# EAGLE design zepir-LCD-audio (EAGLE 7.6.0)
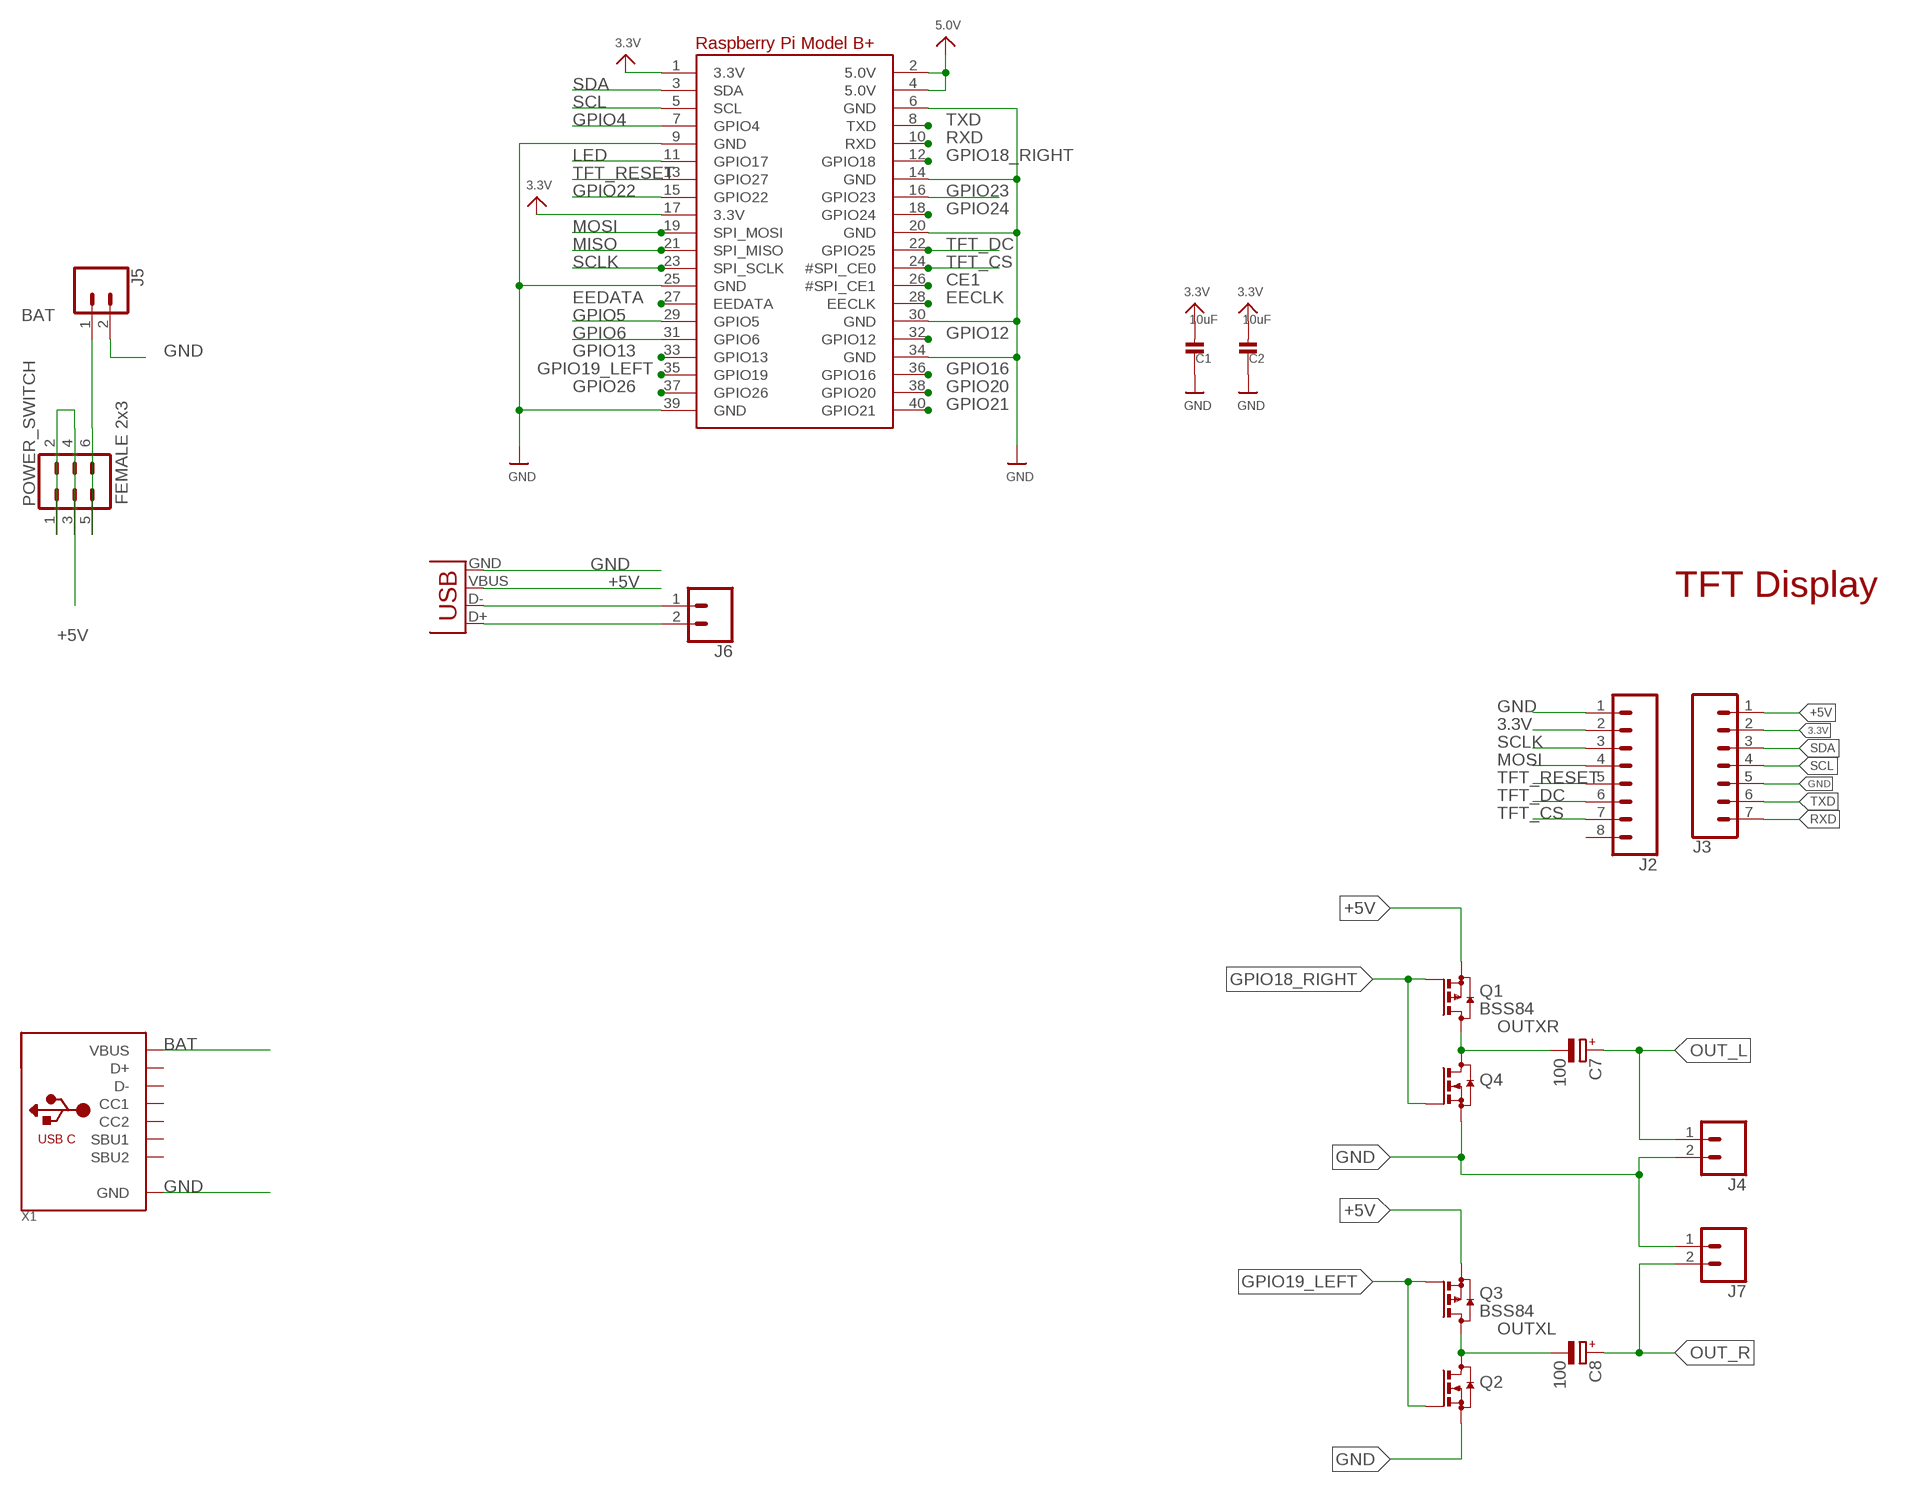
[diagram p0: schematic, sheet 1]

## Parts
C1  10uF  CAP_CERAMIC_1206  [_1206]
C2  10uF  CAP_CERAMIC_1206  [_1206]
C7  100  CPOL-EUB/3528-21R  [B/3528-21R]
C8  100  CPOL-EUB/3528-21R  [B/3528-21R]
J2  CONN_08LONGPADS  [1X08_LONGPADS]
J3  CONN_07LONGPADS  [1X07_LONGPADS]
J4  CONN_02PTH3  [1X02_LONGPADS]
J5  CONN_02PTH3  [1X02_LONGPADS]
J6  CONN_02  [1X02]
J7  CONN_02PTH3  [1X02_LONGPADS]
POWER_SWITCH  FEMALE 2x3  CONN_03X2FEMALE  [2X3]
Q1  BSS84  [SOT23]
Q2  BSS123  [SOT23]
Q3  BSS84  [SOT23]
Q4  BSS123  [SOT23]
RPI1  RASPBERRYPI_BPLUS_BONNETNODIM  [PI_BONNET_NODIM]
USBIN1  USB-A-SMD  [USB-A-S-NOSILK-FEMALE]
X1  USB_C  [USB_C_CUSB31-CFM2AX-01-X]

## Nets
3.3V: C1.2 C2.2 J2.2 J3.2 RPI1.1(3.3V) RPI1.17(3.3V)
+5V [xxx]: J3.1 POWER_SWITCH.1 POWER_SWITCH.2 POWER_SWITCH.3 POWER_SWITCH.4 Q1.2(S) Q3.2(S) RPI1.2(5.0V) RPI1.4(5.0V) USBIN1.VBUS ; supply symbol labelled 5.0V
BAT: J5.1 POWER_SWITCH.5 POWER_SWITCH.6 X1.A4B9(VBUS) X1.B4A9(VBUS)
CE1: RPI1.26(#SPI_CE1)
DM: J6.1 USBIN1.D-
DP: J6.2 USBIN1.D+
EECLK: RPI1.28(EECLK)
EEDATA: RPI1.27(EEDATA)
GND [gnd]: C1.1 C2.1 J2.1 J3.5 J4.2 J5.2 J7.1 Q2.2(S) Q4.2(S) RPI1.6(GND) RPI1.9(GND) RPI1.14(GND) RPI1.20(GND) RPI1.25(GND) RPI1.30(GND) RPI1.34(GND) RPI1.39(GND) USBIN1.GND X1.A1B12(GND) X1.B1A12(GND)
GPIO4: RPI1.7(GPIO4)
GPIO5: RPI1.29(GPIO5)
GPIO6: RPI1.31(GPIO6)
GPIO12: RPI1.32(GPIO12)
GPIO13: RPI1.33(GPIO13)
GPIO16: RPI1.36(GPIO16)
GPIO18_RIGHT: Q1.1(G) Q4.1(G) RPI1.12(GPIO18)
GPIO19_LEFT: Q2.1(G) Q3.1(G) RPI1.35(GPIO19)
GPIO20: RPI1.38(GPIO20)
GPIO21: RPI1.40(GPIO21)
GPIO22: RPI1.15(GPIO22)
GPIO23: RPI1.16(GPIO23)
GPIO24: RPI1.18(GPIO24)
GPIO26: RPI1.37(GPIO26)
LED: RPI1.11(GPIO17)
MISO: RPI1.21(SPI_MISO)
MOSI: J2.4 RPI1.19(SPI_MOSI)
OUT_L: C7.+ J4.1
OUT_R: C8.+ J7.2
OUTXL: C8.- Q2.3(D) Q3.3(D)
OUTXR: C7.- Q1.3(D) Q4.3(D)
RXD: J3.7 RPI1.10(RXD)
SCL: J3.4 RPI1.5(SCL)
SCLK: J2.3 RPI1.23(SPI_SCLK)
SDA: J3.3 RPI1.3(SDA)
TFT_CS: J2.7 RPI1.24(#SPI_CE0)
TFT_DC: J2.6 RPI1.22(GPIO25)
TFT_RESET: J2.5 RPI1.13(GPIO27)
TXD: J3.6 RPI1.8(TXD)
Unconnected: J2.8 X1.A5(CC1) X1.A6(D+) X1.A7(D-) X1.A8(SBU1) X1.B5(CC2) X1.B6(D+) X1.B7(D-) X1.B8(SBU2)

## Notes on the sheet
- TFT Display

## Library data of the parts
C1 C2 = microbuilder:CAP_CERAMIC: Ceramic Capacitors For new designs, use the packages preceded by an '_' character since they are more reliable: The following footprints should be used on most boards: _0402 - Standard footprint for regular board layouts _0603 - Standard footprint for regular board layouts _0805 - Standard footprint for regular board layouts _1206 - Standard footprint for regular board layouts For extremely tight-pitch boards where space is at a premium, the following 'micro-pitch' footprints can be used (smaller pads, no silkscreen outline, etc.): _0402MP - Micro-pitch footprint for very dense/compact boards _0603MP - Micro-pitch footprint for very dense/compact boards _0805MP - Micro-pitch footprint for very dense/compact boards _1206MP - Micro-pitch footprint for very dense/compact boards
C7 C8 = resistor:CPOL-EU: POLARIZED CAPACITOR, European symbol
J2 = SparkFun-Connectors:CONN_08: Multi connection point. Often used as Generic Header-pin footprint for 0.1 inch spaced/style header connections On any of the 0.1 inch spaced packages, you can populate with these: Break Away Headers - Straight <https://www.sparkfun.com/products/116> (PRT-00116) Break Away Male Headers - Right Angle <https://www.sparkfun.com/products/553> (PRT-00553) Female Headers <https://www.sparkfun.com/products/115> (PRT-00115) Break Away Headers - Machine Pin <https://www.sparkfun.com/products/117> (PRT-00117) Break Away Female Headers - Swiss Machine Pin <https://www.sparkfun.com/products/743> (PRT-00743) Arduino Stackable Header - 8 Pin <https://www.sparkfun.com/products/9279> (PRT-09279) For SCREWTERMINALS and SPRING TERMINALS visit here: Screw Terimnals on SparkFun.com <https://www.sparkfun.com/search/results?term=Screw+Terminals> (5mm/3.5mm/2.54mm spacing) This device is also useful as a general connection point to wire up your design to another part of your project. Our various solder wires solder well into these plated through hole pads. Hook-Up Wire - Assortment (Stranded, 22 AWG) <https://www.sparkfun.com/products/11375> (PRT-11375) Hook-Up Wire - Assortment (Solid Core, 22 AWG) <https://www.sparkfun.com/products/11367> (PRT-11367) View the entire wire category on our website here <https://www.sparkfun.com/categories/141> Special notes: Molex polarized connector foot print use with SKU : PRT-08231 with associated crimp pins and housings. 1MM SMD Version SKU: PRT-10208 NOTES ON THE VARIANTS LOCK and LOCK_LONGPADS... This footprint was designed to help hold the alignment of a through-hole component (i.e. 6-pin header) while soldering it into place. You may notice that each hole has been shifted either up or down by 0.005 of an inch from it's more standard position (which is a perfectly straight line). This slight alteration caused the pins (the squares in the middle) to touch the edges of the holes. Because they are alternating, it causes a "brace" to hold the component in place. 0.005 has proven to be the perfect amount of "off-center" position when using our standard breakaway headers. Although looks a little odd when you look at the bare footprint, once you have a header in there, the alteration is very hard to notice. Also,if you push a header all the way into place, it is covered up entirely on the bottom side.
J3 = SparkFun-Connectors:CONN_07: Multi connection point. Often used as Generic Header-pin footprint for 0.1 inch spaced/style header connections On any of the 0.1 inch spaced packages, you can populate with these: Break Away Headers - Straight <https://www.sparkfun.com/products/116> (PRT-00116) Break Away Male Headers - Right Angle <https://www.sparkfun.com/products/553> (PRT-00553) Female Headers <https://www.sparkfun.com/products/115> (PRT-00115) Break Away Headers - Machine Pin <https://www.sparkfun.com/products/117> (PRT-00117) Break Away Female Headers - Swiss Machine Pin <https://www.sparkfun.com/products/743> (PRT-00743) For SCREWTERMINALS and SPRING TERMINALS visit here: Screw Terimnals on SparkFun.com <https://www.sparkfun.com/search/results?term=Screw+Terminals> (5mm/3.5mm/2.54mm spacing) This device is also useful as a general connection point to wire up your design to another part of your project. Our various solder wires solder well into these plated through hole pads. Hook-Up Wire - Assortment (Stranded, 22 AWG) <https://www.sparkfun.com/products/11375> (PRT-11375) Hook-Up Wire - Assortment (Solid Core, 22 AWG) <https://www.sparkfun.com/products/11367> (PRT-11367) View the entire wire category on our website here <https://www.sparkfun.com/categories/141> Special notes: Molex polarized connector foot print use with SKU : PRT-08231 with associated crimp pins and housings. 1MM SMD Version SKU: PRT-10208 NOTES ON THE VARIANTS LOCK and LOCK_LONGPADS... This footprint was designed to help hold the alignment of a through-hole component (i.e. 6-pin header) while soldering it into place. You may notice that each hole has been shifted either up or down by 0.005 of an inch from it's more standard position (which is a perfectly straight line). This slight alteration caused the pins (the squares in the middle) to touch the edges of the holes. Because they are alternating, it causes a "brace" to hold the component in place. 0.005 has proven to be the perfect amount of "off-center" position when using our standard breakaway headers. Although looks a little odd when you look at the bare footprint, once you have a header in there, the alteration is very hard to notice. Also,if you push a header all the way into place, it is covered up entirely on the bottom side.
J4-J7 = SparkFun-Connectors:CONN_02: Multi connection point. Often used as Generic Header-pin footprint for 0.1 inch spaced/style header connections On any of the 0.1 inch spaced packages, you can populate with these: Break Away Headers - Straight <https://www.sparkfun.com/products/116> (PRT-00116) Break Away Male Headers - Right Angle <https://www.sparkfun.com/products/553> (PRT-00553) Female Headers <https://www.sparkfun.com/products/115> (PRT-00115) Break Away Headers - Machine Pin <https://www.sparkfun.com/products/117> (PRT-00117) Break Away Female Headers - Swiss Machine Pin <https://www.sparkfun.com/products/743> (PRT-00743) For SCREWTERMINALS and SPRING TERMINALS visit here: Screw Terimnals on SparkFun.com <https://www.sparkfun.com/search/results?term=Screw+Terminals> (5mm/3.5mm/2.54mm spacing) This device is also useful as a general connection point to wire up your design to another part of your project. Our various solder wires solder well into these plated through hole pads. Hook-Up Wire - Assortment (Stranded, 22 AWG) <https://www.sparkfun.com/products/11375> (PRT-11375) Hook-Up Wire - Assortment (Solid Core, 22 AWG) <https://www.sparkfun.com/products/11367> (PRT-11367) View the entire wire category on our website here <https://www.sparkfun.com/categories/141> Special notes: Molex polarized connector foot print use with: PRT-08233 with associated crimp pins and housings. 2.54_SCREWTERM for use with PRT-10571. 3.5mm Screw Terminal footprints for PRT-08084 5mm Screw Terminal footprints for use with PRT-08432
POWER_SWITCH = SparkFun-Connectors:CONN_03X2: Multi connection point. Often used as Generic Header-pin footprint for 0.1 inch spaced/style header connections You can populate with any combo of single row headers, but if you'd like an exact match, check these: Header - 2x3 (Male, 0.1") <https://www.sparkfun.com/products/12807> (PRT-12807) Header - 2x3 (Female, 0.1") <https://www.sparkfun.com/products/13010> (PRT-13010) 2x3 Pin Shrouded Header <https://www.sparkfun.com/products/10877> (PRT-10877) On any of the 0.1 inch spaced packages, you can populate with these: Break Away Headers - Straight <https://www.sparkfun.com/products/116> (PRT-00116) Break Away Male Headers - Right Angle <https://www.sparkfun.com/products/553> (PRT-00553) Female Headers <https://www.sparkfun.com/products/115> (PRT-00115) Break Away Headers - Machine Pin <https://www.sparkfun.com/products/117> (PRT-00117) Break Away Female Headers - Swiss Machine Pin <https://www.sparkfun.com/products/743> (PRT-00743) Special note: the shrouded connector mates well with our 3x2 ribbon cables: Ribbon Crimp Connector - 6-pin (2x3, Female) <https://www.sparkfun.com/products/10651> (PRT-10651) Ribbon Cable - 6 wire (15ft) <https://www.sparkfun.com/products/10646> (PRT-10646); PROD_ID: CONN-11566
Q1 Q3 = transistor-small-signal:BSS84: P-CHANNEL MOS FET
Q2 Q4 = transistor-small-signal:BSS123: N-CHANNEL MOS FET
RPI1 = adafruit_sbc:RASPBERRYPI_BPLUS
USBIN1 = SparkFun:USB: USB Connectors USB-B-PTH is fully proven SKU : PRT-00139 USB-miniB is fully proven SKU : PRT-00587 USB-A-PCB is untested. USB-A-H is throughly reviewed, but untested. Spark Fun Electronics SKU : PRT-00437 USB-B-SMT is throughly reviewed, but untested. Needs silkscreen touching up. USB-A-S has not been used/tested USB-MB-H has not been used/tested
X1 = microbuilder:USB_C: USB Type-C USB 2.0 Connector

## Net classes
0 vcc: width 0.203 mm, drill 0.356 mm, clearance 0.305 mm
1 gnd: width 0.203 mm, drill 0.356 mm, clearance 0.305 mm
2 xxx: width 0.203 mm, drill 0.356 mm, clearance 0.305 mm

## Board
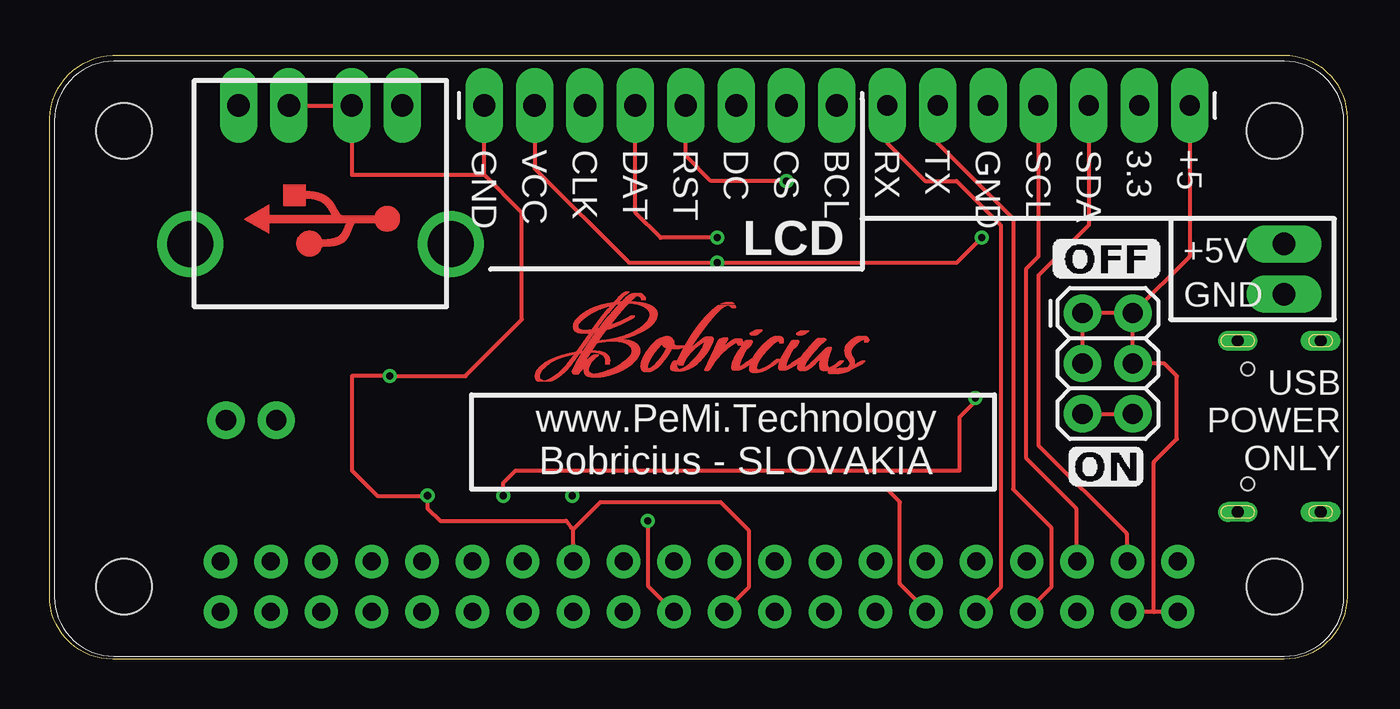
[diagram p1: board, top side]
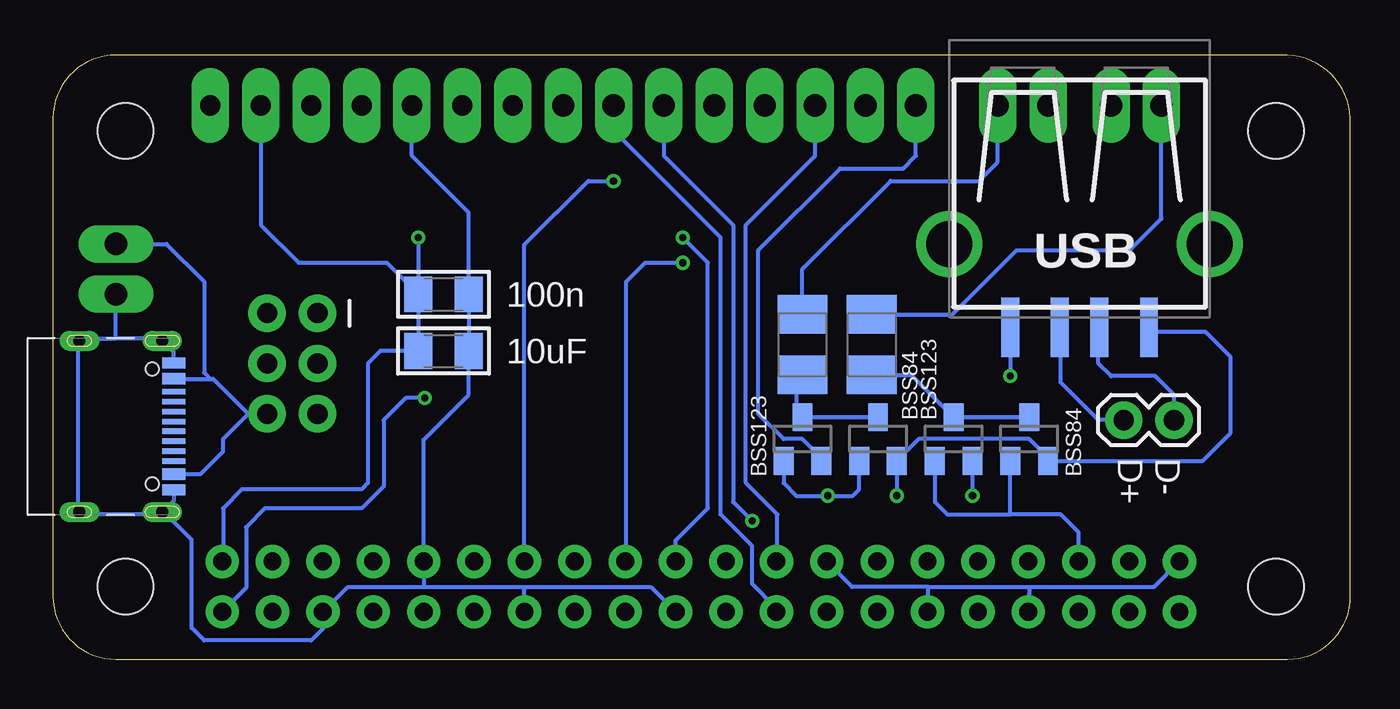
[diagram p2: board, bottom side, seen from below]

Size 65.41 x 30.48 mm. Coordinates in mm from the lower left corner, seen from the top.
Outline: 3.49,30.48 62.23,30.48 arc-90 65.41,27.31 65.41,3.17 arc-90 62.23,0 3.18,0 arc-90 0,3.17 0,27.31 arc-90 3.49,30.48
Copper layers (1*16): Top 0.0356mm / dielectric 1.5011mm / Bottom 0.0356mm
Design rules "LaenPCBOrder *": minimum track width 6mil, minimum drill 13mil, track to track 6mil, track to pad 6mil, pad to pad 6mil, via to via 6mil, smd to smd 6mil, copper to edge 15mil, drill to drill 6mil, minimum pad ring 7mil, minimum via ring 7mil, stop-mask expansion 4mil, vias tented up to drill 30mil, thermal gap 10mil

### Footprints (pad centres in the part's own frame; a part is rotated, then mirrored left to right if it is on the bottom)
_1206 = smd 1.4 x 1.8: 1 -1.27,0; 2 1.27,0
B/3528-21R = smd 1.95 x 2.5: + 1.525,0; - -1.525,0
1X08_LONGPADS = drill 1.118 pad 1.88 long: 1 0,0; 2 2.54,0; 3 5.08,0; 4 7.62,0; 5 10.16,0; 6 12.7,0; 7 15.24,0; 8 17.78,0
1X07_LONGPADS = drill 1.016 pad 1.88 long: 1 0,0; 2 2.54,0; 3 5.08,0; 4 7.62,0; 5 10.16,0; 6 12.7,0; 7 15.24,0
1X02_LONGPADS = drill 1.118 pad 1.88 long: 1 0,0; 2 2.54,0
1X02 = drill 1.016 pad 1.88: 1 0,0; 2 2.54,0
2X3 = drill 1.016 pad 1.88: 1 0,0; 2 0,2.54; 3 2.54,0; 4 2.54,2.54; 5 5.08,0; 6 5.08,2.54
SOT23 = smd 1 x 1.4: 1 -0.95,-1.1; 2 0.95,-1.1; 3 0,1.1
PI_BONNET_NODIM = drill 0.9 pad 1.676: 1 8.37,25.23; 2 8.37,27.77; 3 10.91,25.23; 4 10.91,27.77; 5 13.45,25.23; 6 13.45,27.77; 7 15.99,25.23; 8 15.99,27.77; 9 18.53,25.23; 10 18.53,27.77; 11 21.07,25.23; 12 21.07,27.77; 13 23.61,25.23; 14 23.61,27.77; 15 26.15,25.23; 16 26.15,27.77; 17 28.69,25.23; 18 28.69,27.77; 19 31.23,25.23; 20 31.23,27.77; 21 33.77,25.23; 22 33.77,27.77; 23 36.31,25.23; 24 36.31,27.77; 25 38.85,25.23; 26 38.85,27.77; 27 41.39,25.23; 28 41.39,27.77; 29 43.93,25.23; 30 43.93,27.77; 31 46.47,25.23; 32 46.47,27.77; 33 49.01,25.23; 34 49.01,27.77; 35 51.55,25.23; 36 51.55,27.77; 37 54.09,25.23; 38 54.09,27.77; 39 56.63,25.23; 40 56.63,27.77 | hole 2.8: 3.5,3.5; 3.5,26.5; 61.5,26.5; 61.5,3.5
USB-A-S-NOSILK-FEMALE = smd 3 x 0.9: D+ 4.212,-1; D- 4.212,1; GND 4.212,-3.5; VBUS 4.212,3.5 | drill 2.311: P$5 0,-6.566; P$6 0,6.566
USB_C_CUSB31-CFM2AX-01-X = smd 0.575 x 1.15: A1B12 -3.2,7.355; A4B9 -2.4,7.355; B1A12 3.2,7.355; B4A9 2.4,7.355 | smd 0.275 x 1.15: A5 -1.25,7.355; A6 -0.25,7.355; A7 0.25,7.355; A8 1.25,7.355; B5 1.75,7.355; B6 0.75,7.355; B7 -0.75,7.355; B8 -1.75,7.355 | drill 0.6 pad 1 long: M1 -4.32,6.78; M2 4.32,6.78; M3 -4.32,2.6; M4 4.32,2.6 | hole 0.65: 2.89,6.28; -2.89,6.28

### Placement (x,y rotation side)
C1  45.72,18.42 180 bottom
C2  45.72,15.56 180 bottom
C7  27.62,15.88 90 bottom
C8  24.13,15.88 90 bottom
J2  21.91,27.94 0 top
J3  57.47,27.94 180 top
J4  17.78,27.94 180 top
J5  62.23,20.96 270 top
J6  8.89,12.07 180 bottom
J7  12.07,27.94 180 top
POWER_SWITCH  52.07,17.46 270 top
Q1  23.81,11.11 0 bottom
Q2  20,11.11 0 bottom
Q3  16.19,11.11 0 bottom
Q4  27.62,11.11 0 bottom
RPI1  65.25,30.16 180 top
USBIN1  13.65,20.96 270 bottom
X1  66.68,11.75 270 bottom

### Tracks (layer width: path | path; a pad name or v marks a point on that pad's centre or on a via)
3.3V  (via drill 0.36)
  Top 0.203: J2.2 24.45,24.77 29.21,20 v33.65,20 45.72,20 v46.99,21.27 | v36.51,4.98 RPI1.17
  Bottom 0.203: RPI1.1 56.83,4.98 56.83,7.62 55.88,8.57 49.85,8.57 49.53,8.89 49.53,14.92 48.9,15.56 C2.2 C1.2 | J3.2 54.93,21.91 53.02,20 48.58,20 C1.2 | v36.51,4.98 36.51,19.05 35.56,20 v33.65,20 | v46.99,21.27 C1.2
+5V  (via drill 0.36)
  Top 0.203: J3.1 57.47,20.32 POWER_SWITCH.2 | POWER_SWITCH.2 POWER_SWITCH.1 POWER_SWITCH.3 | POWER_SWITCH.2 POWER_SWITCH.4 56.2,14.92 56.83,14.29 56.83,11.11 55.67,9.95 55.67,2.39 | RPI1.2 55.67,2.39 | 55.67,2.39 RPI1.4 | v22.86,8.26 22.86,8.89 23.49,9.53 45.88,9.53 45.88,12.22 46.67,13.02 v46.67,13.18
  Bottom 0.203: v46.67,13.18 47.62,13.18 48.74,12.06 48.74,8.73 49.85,7.62 54.72,7.62 55.67,6.67 55.67,3.6 RPI1.2 | USBIN1.VBUS 9.92,16.51 7.3,16.51 6.03,15.24 6.03,11.43 7.45,10.01 Q3.2 15.24,10.16 16.19,11.11 21.76,11.11 Q1.2 v22.86,8.26
BAT
  Top 0.203: POWER_SWITCH.5 POWER_SWITCH.6
  Bottom 0.203: POWER_SWITCH.6 55.56,12.38 | 55.56,12.38 57.33,14.15 57.47,14.15 | X1.A4B9 57.47,14.15 | X1.B4A9 57.96,9.35 56.83,10.48 56.83,11.11 55.56,12.38 | J5.1 59.69,20.96 57.79,19.05 57.79,14.46 57.47,14.15
DM
  Bottom 0.203: J6.1 8.89,13.34 9.84,14.29 12.07,14.29 12.7,14.92 12.7,16.7 USBIN1.D-
DP
  Bottom 0.203: J6.2 12.7,12.06 14.6,13.97 14.6,16.7 USBIN1.D+
GND  (via drill 0.36)
  Top 0.203: 21.91,24.45 15.24,24.45 J4.2 J7.1 | 21.91,24.45 J2.1 | RPI1.25 26.4,6.55 | 26.4,6.55 27.78,7.94 33.81,7.94 35.24,6.51 35.24,3.62 RPI1.20 | 26.4,6.55 26.28,6.67 26.04,6.99 19.68,6.99 19.05,7.62 v19.05,8.26 16.51,8.26 15.24,9.53 15.24,14.29 v17.15,14.29 20.96,14.29 23.81,17.14 23.81,22.54 21.91,24.45
  Bottom 0.203: J3.5 47.31,25.4 44.45,22.54 C1.1 C2.1 44.45,13.34 46.72,11.07 RPI1.9 46.72,3.69 46.67,3.65 | X1.B1A12 59.32,7.99 59.85,7.46 | 59.85,7.46 60.01,7.3 64.13,7.3 64.13,16.19 62.23,16.19 | 62.23,16.19 60.01,16.19 59.32,15.5 X1.A1B12 | 62.23,16.19 J5.2 | 16.2,3.65 16.2,3.31 RPI1.34 | 46.67,3.65 41.75,3.65 | 41.75,3.65 35.27,3.65 RPI1.20 | RPI1.14 41.64,3.54 41.75,3.65 | 46.67,3.65 50.54,3.65 RPI1.6 51.8,1.54 52.39,0.95 57.79,0.95 58.42,1.59 58.42,6.03 59.85,7.46 | RPI1.30 21.27,2.44 21.27,3.65 | 21.27,3.65 16.2,3.65 | 21.27,3.65 25.12,3.65 RPI1.25 | 16.2,3.65 9.9,3.65 RPI1.39 | Q2.2 v19.05,8.26 | USBIN1.GND v17.15,14.29 | Q4.2 26.67,10.16 27.62,11.11 28.57,11.11 29.85,12.38 29.85,20.64 25.72,24.77 22.54,24.77 21.91,25.4 J2.1
GPIO18_RIGHT  (via drill 0.36)
  Top 0.203: RPI1.12 44.18,2.5 42.86,3.81 42.86,7.94 42.23,8.57 26.67,8.57 v26.35,8.26
  Bottom 0.203: Q4.1 28.57,8.89 27.94,8.26 v26.35,8.26 25.08,8.26 24.76,8.57 Q1.1
GPIO19_LEFT
  Bottom 0.203: Q2.1 20.95,7.94 20.32,7.3 17.15,7.3 | 17.15,7.3 Q3.1 | RPI1.35 13.7,6.39 14.6,7.3 17.15,7.3
MOSI  (via drill 0.36)
  Top 0.203: v33.65,21.27 30.8,21.27 29.53,22.54 J2.4
  Bottom 0.203: RPI1.19 34.02,5.99 32.38,7.62 32.38,20 v33.65,21.27
OUT_L
  Bottom 0.203: C7.+ 27.62,19.68 23.18,24.13 18.73,24.13 17.78,25.08 J4.1
OUT_R
  Bottom 0.203: C8.+ 20.07,17.4 16.83,20.64 11.11,20.64 9.52,22.23 J7.2
OUTXL
  Bottom 0.203: Q3.3 Q2.3 22.14,14.35 C8.-
OUTXR
  Bottom 0.203: Q1.3 Q4.3 | Q4.3 27.94,12.21 27.94,12.7 | 27.94,12.7 27.62,12.7 Q4.3 | C7.- 27.94,14.35 27.94,12.7
RXD
  Top 0.203: J3.7 42.23,26.03 44.13,24.13 45.72,24.13 47.94,21.91 47.94,3.62 RPI1.10
SCL
  Top 0.203: J3.4 49.85,20.32 49.21,19.68 49.21,10.16 51.75,7.62 51.75,4.98 RPI1.5
SCLK
  Bottom 0.203: RPI1.23 28.89,5.08 28.89,7.3 30.48,8.89 30.48,21.91 26.99,25.4 J2.3
SDA
  Top 0.203: J3.3 52.39,21.91 49.85,19.37 49.85,10.79 54.29,6.35 54.29,4.98 RPI1.3
TFT_CS
  Bottom 0.203: RPI1.24 28.94,2.58 30.16,3.81 30.16,5.71 31.75,7.3 31.75,21.27 37.15,26.67 J2.7
TFT_DC  (via drill 0.36)
  Top 0.203: v30.16,6.99 30.16,3.71 RPI1.22
  Bottom 0.203: J2.6 34.61,25.4 31.12,21.91 31.12,7.94 v30.16,6.99
TFT_RESET  (via drill 0.36)
  Top 0.203: v37.15,24.13 33.34,24.13 32.07,25.4 J2.5
  Bottom 0.203: RPI1.13 41.64,20.91 38.42,24.13 v37.15,24.13
TXD
  Top 0.203: J3.6 44.77,26.03 48.58,22.23 48.58,8.57 50.48,6.67 50.48,3.62 RPI1.8
(copper drawn outside any net)
  shapes: Top area x2018

### Text on the board
tNames: GND | VCC | CLK | DAT | RST | DC | CS | BCL | RX | TX | GND | SCL | SDA | 3.3 | +5 | LCD | +5V | GND | USB / POWER / ONLY | www.PeMi.Technology / Bobricius - SLOVAKIA
bNames: USB | 100n | 10uF | BSS123 | BSS84 | D- / D+ | BSS84 | BSS123